# EAGLE schematic schematic (EAGLE 9.6.2)
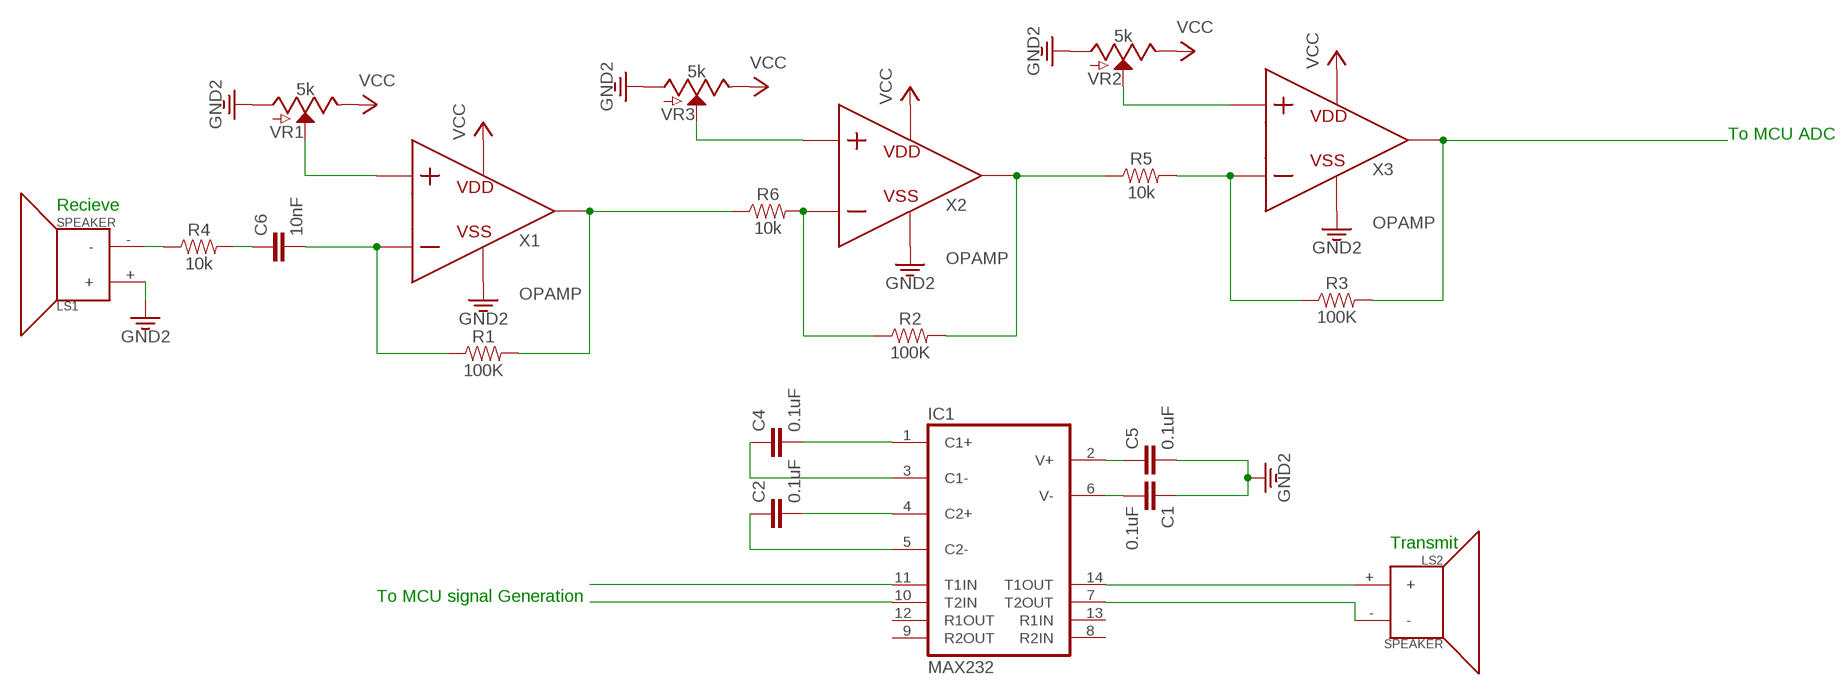
[diagram p0: schematic, sheet 1]

## Parts
C1  0.1uF  0.1UF-0402-6.3V-10%-X7R  [0402]
C2  0.1uF  0.1UF-0402-6.3V-10%-X7R  [0402]
C4  0.1uF  0.1UF-0402-6.3V-10%-X7R  [0402]
C5  0.1uF  0.1UF-0402-6.3V-10%-X7R  [0402]
C6  10nF  10NF-0402T-25V-10%  [0402-TIGHT]
IC1  MAX232  [DIL16]
LS1  SPEAKER  [PCB_MOUNT_SPEAKER]
LS2  SPEAKER  [PCB_MOUNT_SPEAKER]
R1  100K  100KOHM-0402-1/16W-1%  [0402]
R2  100K  100KOHM-0402-1/16W-1%  [0402]
R3  100K  100KOHM-0402-1/16W-1%  [0402]
R4  10k  10KOHM-0402-1/16W-1%  [0402]
R5  10k  10KOHM-0402-1/16W-1%  [0402]
R6  10k  10KOHM-0402-1/16W-1%  [0402]
VR1  5k  POTENTIOMETER-PTH-9MM-1/20W-20%  [POT-PTH-ALPS]
VR2  5k  POTENTIOMETER-PTH-9MM-1/20W-20%  [POT-PTH-ALPS]
VR3  5k  POTENTIOMETER-PTH-9MM-1/20W-20%  [POT-PTH-ALPS]
X1  OPAMP  (no package)
X2  OPAMP  (no package)
X3  OPAMP  (no package)

## Nets
3.3V: C1.1 C5.2 LS1.+ VR1.P$3(A) VR2.P$3(A) VR3.P$3(A) X1.VSS X2.VSS X3.VSS ; supply symbol labelled GND2
N$1: LS1.- R4.1
N$2: C6.1 R4.2
N$3: C6.2 R1.1 X1.N
N$4: R1.2 R6.1 X1.VOUT
N$5: VR1.P$2(S) X1.P
N$6: R2.2 R5.1 X2.VOUT
N$7: VR3.P$2(S) X2.P
N$8: R3.1 R5.2 X3.N
N$9: VR2.P$2(S) X3.P
N$10: R2.1 R6.2 X2.N
N$11: R3.2 X3.VOUT
N$12: C5.1 IC1.2(V+)
N$14: IC1.14(T1OUT) LS2.+
N$15: IC1.7(T2OUT) LS2.-
N$16: IC1.11(T1IN)
N$17: IC1.10(T2IN)
N$18: C4.2 IC1.1(C1+)
N$19: C4.1 IC1.3(C1-)
N$20: C2.2 IC1.4(C2+)
N$21: C2.1 IC1.5(C2-)
N$22: C1.2 IC1.6(V-)
VCC: VR1.P$1(E) VR2.P$1(E) VR3.P$1(E) X1.VDD X2.VDD X3.VDD
Unconnected: IC1.8(R2IN) IC1.9(R2OUT) IC1.12(R1OUT) IC1.13(R1IN)

## Notes on the sheet
- To MCU ADC
- Recieve
- Transmit
- To MCU signal Generation

## Power pins joined to a net without a drawn wire
GND: IC1.15(GND)
VCC: IC1.16(VCC)

## Library data of the parts
C1 C2 C4 C5 = SparkFun-Capacitors:0.1UF: 0.1µF ceramic capacitors A capacitor is a passive two-terminal electrical component used to store electrical energy temporarily in an electric field.; PROD_ID: CAP-14993
C6 = SparkFun-Capacitors:10NF: 0.01uF/10nF/10,000pF ceramic capacitors A capacitor is a passive two-terminal electrical component used to store electrical energy temporarily in an electric field. CAP-09321; PROD_ID: CAP-14847
IC1 = maxim:MAX232: RS232 TRANSCEIVER; MF: MAXIM; MPN: MAX232ACPE+; OC_FARNELL: 9723773; OC_NEWARK: 68K4544
LS1 LS2 = SparkFun-Electromechanical:SPEAKER: Speaker Generic 2-terminal loudspeakers SparkFun Products Speaker - PCB Mount <https://www.sparkfun.com/products/11089> (COM-11089); PROD_ID: COMP-11789; SF_SKU: COM-11089
R1-R3 = SparkFun-Resistors:100KOHM: 100kΩ resistor A resistor is a passive two-terminal electrical component that implements electrical resistance as a circuit element. Resistors act to reduce current flow, and, at the same time, act to lower voltage levels within circuits. - Wikipedia; PROD_ID: RES-13495
R4-R6 = SparkFun-Resistors:10KOHM: 10kΩ resistor A resistor is a passive two-terminal electrical component that implements electrical resistance as a circuit element. Resistors act to reduce current flow, and, at the same time, act to lower voltage levels within circuits. - Wikipedia; PROD_ID: RES-14241
VR1-VR3 = SparkFun-Resistors:POTENTIOMETER: Potentiometer (Pot) Three-terminal potentiometers, with an adjustable wiper and two adjustable resistors. A pot can be used to create a configurable voltage divider, or as a variable resistor. Variants ALPS_POT and ALPS_POT_KIT - PTH, breadboard compatible, 9mm square pots Rotary Potentiometer - Linear (10k ohm) <https://www.sparkfun.com/products/9288> (COM-09288) The KIT variant exposes copper on only one side of the PTH pad, so the part can only be assembled on one side of the PCB. Useful for beginner soldering kits.; PROD_ID: RES-09177; SF_SKU: COM-09288; VALUE: 10k
X1-X3 = ngspice-simulation:OPAMP: Operational amplifier with power pins